# EAGLE design wt12_uart_breakout_board_v10 (EAGLE 5.11)
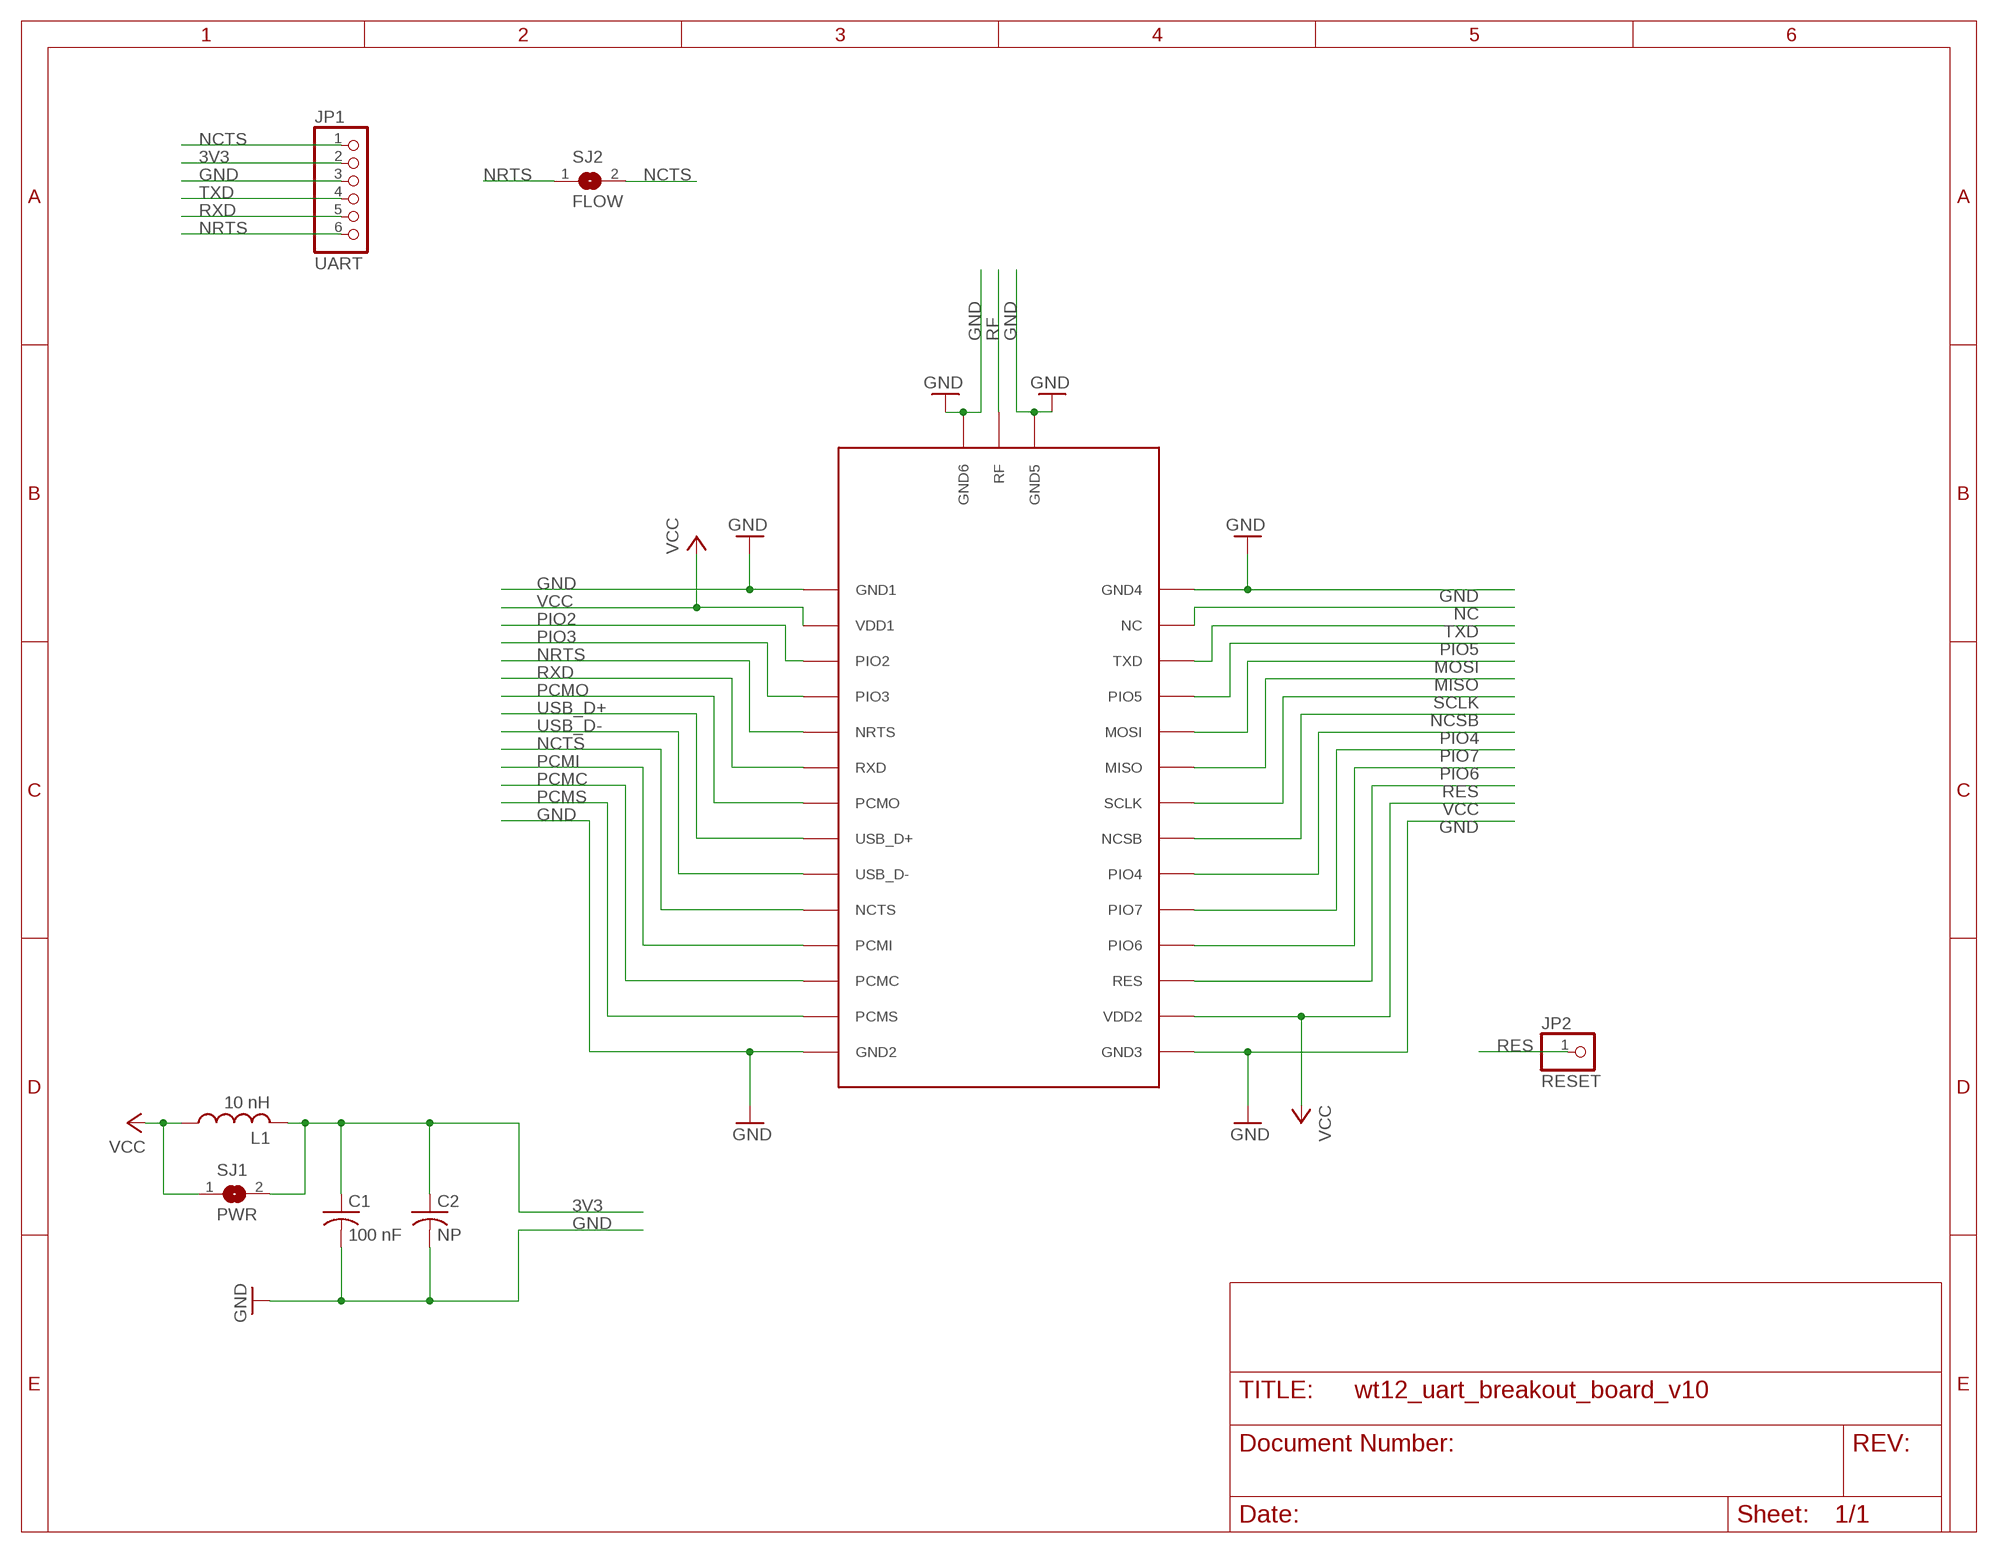
[diagram p0: schematic, sheet 1]

## Parts
C1  100 nF  C-US025-025X050  [C025-025X050]
C2  NP  C-US025-025X050  [C025-025X050]
JP1  UART  PINHD-1X6  [1X06]
JP2  RESET  PINHD-1X1  [1X01]
L1  10 nH  L-US0204/7  [0204/7]
SJ1  PWR  SJ  [SJ]
SJ2  FLOW  SJ  [SJ]
U1  WT12  [WT12]

## Nets
3V3: C1.1 C2.1 JP1.2 L1.2 SJ1.2
GND: C1.2 C2.2 JP1.3 U1.GND1 U1.GND2 U1.GND3 U1.GND4 U1.GND5 U1.GND6
MISO: U1.MISO
MOSI: U1.MOSI
NC: U1.NC
NCSB: U1.NCSB
NCTS: JP1.1 SJ2.2 U1.NCTS
NRTS: JP1.6 SJ2.1 U1.NRTS
PCMC: U1.PCMC
PCMI: U1.PCMI
PCMO: U1.PCMO
PCMS: U1.PCMS
PIO2: U1.PIO2
PIO3: U1.PIO3
PIO4: U1.PIO4
PIO5: U1.PIO5
PIO6: U1.PIO6
PIO7: U1.PIO7
RES: JP2.1 U1.RES
RF: U1.RF
RXD: JP1.5 U1.RXD
SCLK: U1.SCLK
TXD: JP1.4 U1.TXD
USB_D+: U1.USB_D+
USB_D-: U1.USB_D-
VCC: L1.1 SJ1.1 U1.VDD1 U1.VDD2

## Library data of the parts
C1 C2 = resistor:C-US: CAPACITOR, American symbol
JP1 = pinhead:PINHD-1X6: PIN HEADER
JP2 = pinhead:PINHD-1X1: PIN HEADER
L1 = resistor:L-US: INDUCTOR, American symbol
SJ1 SJ2 = jumper:SJ: SMD solder JUMPER
U1 = wt12:WT12: WT12 is a class 2, Bluetooth 2.1 + EDR module. It's a highly integrated Bluetooth module, containing all the necessary elements from Bluetooth radio to antenna, and a fully implemented iWRAP protocol stack. Key Features: - Bluetooth class 2 - Integrated chip antenna - Enhanced Data Rates (EDR) with data throughput up to 2-3Mbps - Support for Adaptive Frequency Hopping (AFH) and 802.11 co-existence - USB version 2.0, UART with bypass mode, GPIO and PCM interfaces - 8MB flash memory - Size: 26 x 14 x 2,4mm - Simple iWRAP firmware for controlling Bluetooth wireless technology - Industrial temperature range from -40C to +85C - Based on CSR BC04 chipset - RoHS compliant - Up to 14 supported Bluetooth profiles in iWRAP firmware - Support for on-board applications - Fully qualified end product with Bluetooth 2.1 + EDR, CE, FCC and IC Bluegiga WT12 provides an ideal solution for developers that want to integrate Bluetooth wireless technology to their design with limited knowledge of Bluetooth and RF technologies. By using WT12 combined with Bluegiga's complete development, testing and verification service offering, and excellent developer support, OEMs and designers ensure that their products reach the market rapidly and cost-effectively in relation to time and resources. Bluegiga has in-house knowledge of both software and hardware - offering customers a single point of contact for all Bluetooth related issues.

## Net classes
0 default: width 0.254 mm, drill 0.508 mm, clearance 0.254 mm

## Board
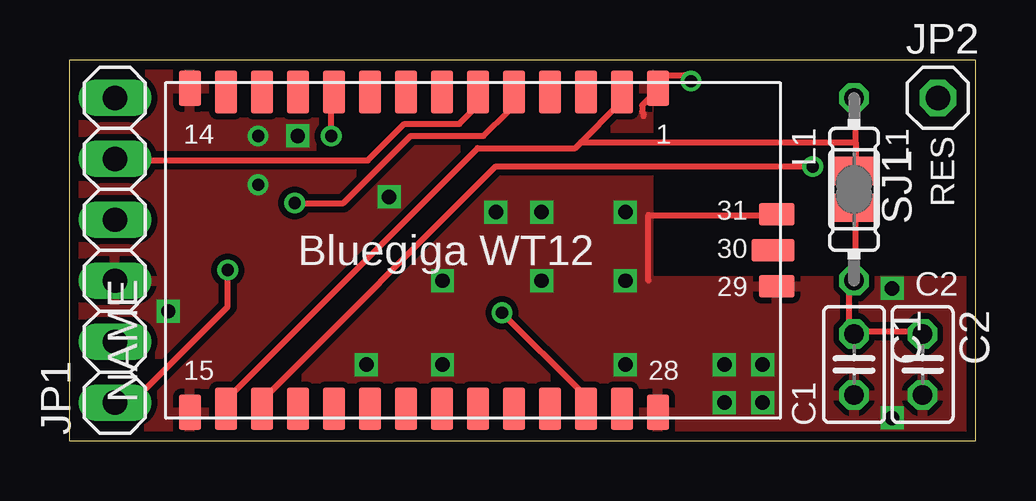
[diagram p1: board, top side]
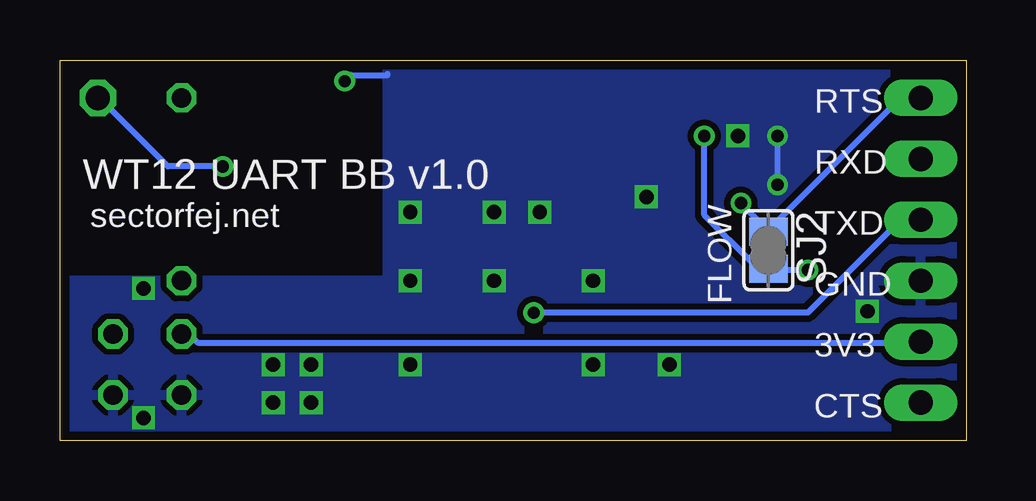
[diagram p2: board, bottom side, seen from below]

Size 37.77 x 15.87 mm. Coordinates in mm from the lower left corner, seen from the top.
Outline: 0,0 37.77,0 37.77,15.87 0,15.87 0,0
Copper layers (1*16): Top 0.0356mm / dielectric 1.5011mm / Bottom 0.0356mm
Design rules "LaenPCBOrder": minimum track width 6mil, minimum drill 13mil, track to track 6mil, track to pad 6mil, pad to pad 6mil, via to via 6mil, smd to smd 6mil, copper to edge 15mil, drill to drill 6mil, minimum pad ring 7mil, minimum via ring 7mil, stop-mask expansion 4mil, vias tented up to drill 0mil, thermal gap 10mil

### Footprints (pad centres in the part's own frame; a part is rotated, then mirrored left to right if it is on the bottom)
C025-025X050 = drill 0.813 octagon: 1 -1.27,0; 2 1.27,0
1X06 = drill 1.016 long: 1 -6.35,0; 2 -3.81,0; 3 -1.27,0; 4 1.27,0; 5 3.81,0; 6 6.35,0
1X01 = drill 1.016 octagon: 1 0,0
0204/7 = drill 0.813 octagon: 1 -3.81,0; 2 3.81,0
SJ = smd 1.168 x 1.6: 1 -0.762,0; 2 0.762,0
WT12 = smd 0.914 x 1.478: GND1 7.7,6.75; GND2 -11.8,6.75; GND3 -11.8,-6.75; GND4 7.7,-6.75 | smd 1.478 x 0.914: GND5 12.65,-1.5; GND6 12.65,1.5 | smd 0.914 x 1.778: MISO 0.2,-6.6; MOSI 1.7,-6.6; NC 6.2,-6.6; NCSB -2.8,-6.6; NCTS -5.8,6.6; NRTS 1.7,6.6; PCMC -8.8,6.6; PCMI -7.3,6.6; PCMO -1.3,6.6; PCMS -10.3,6.6; PIO2 4.7,6.6; PIO3 3.2,6.6; PIO4 -4.3,-6.6; PIO5 3.2,-6.6; PIO6 -7.3,-6.6; PIO7 -5.8,-6.6; RES -8.8,-6.6; RXD 0.2,6.6; SCLK -1.3,-6.6; TXD 4.7,-6.6; USB_D+ -2.8,6.6; USB_D- -4.3,6.6; VDD1 6.2,6.6; VDD2 -10.3,-6.6 | smd 1.778 x 0.914: RF 12.5,0

### Placement (x,y rotation side)
C1  32.7,3.17 270 top
C2  35.56,3.17 270 top
JP1  1.91,7.94 90 top
JP2  36.2,14.29 0 top
L1  32.7,10.48 270 top
SJ1  32.7,10.48 270 top
SJ2  8.26,7.94 270 bottom
U1  16.83,7.94 0 top

### Tracks (layer width: path | path; a pad name or v marks a point on that pad's centre or on a via)
3V3
  Top 0.254: SJ1.2 32.77,9.65 32.77,6.86 L1.2 32.51,6.6 32.51,4.57 C1.1 32.77,4.57 35.56,4.57 C2.1
  Bottom 0.254: JP1.2 2.03,4.06 32,4.06 32.51,4.57 C1.1
GND  (via drill 0.51, 0.6)
  Top 0.254: U1.GND6 29.46,9.4 24.13,9.4 24.13,6.67 | 23.94,13.53 23.88,13.72 23.88,13.97 24.38,14.48 U1.GND1 24.64,14.73 24.64,15.24 25.65,15.24 v25.91,14.99
  Bottom 0.254: v7.87,10.67 v7.87,12.7 | v25.91,14.99 25.65,15.24 24.13,15.24 24.13,15.28
  other vias: 4.13,5.4 12.38,3.17 15.56,3.17 15.56,6.67 19.68,6.67 23.18,6.67 23.18,9.53 19.68,9.53 17.78,9.53 13.34,10.16 9.53,12.7 23.18,3.17 27.3,3.17 27.3,1.59 28.89,1.59 28.89,3.17 34.29,6.35 34.29,0.95
  pour Bottom: 0,15.88 24.13,15.88 24.13,6.67 37.78,6.67 37.78,0 0,0
  pour Top: 0,15.88 24.13,15.88 24.13,6.67 37.78,6.67 37.78,0 0,0
NCTS  (via drill 0.51)
  Top 0.254: v6.6,7.11 6.6,5.59 2.79,1.78 2.03,1.78 JP1.1 | v10.92,12.7 10.92,14.48 U1.NCTS
  Bottom 0.254: v6.6,7.11 8.13,7.11 SJ2.2 8.38,7.37 8.89,7.37 10.92,9.4 v10.92,12.7
NRTS  (via drill 0.51)
  Top 0.254: v9.4,9.91 11.43,9.91 14.22,12.7 17.27,12.7 18.29,13.72 18.29,14.48 U1.NRTS
  Bottom 0.254: JP1.6 2.03,14.22 2.79,14.22 8.13,8.89 SJ2.1 8.38,8.89 v9.4,9.91
RES  (via drill 0.51)
  Top 0.254: v30.99,11.43 17.78,11.43 8.13,1.78 8.13,1.52 U1.RES
  Bottom 0.254: v30.99,11.43 33.27,11.43 36.07,14.22 JP2.1
RXD
  Top 0.254: U1.RXD 17.02,14.48 17.02,13.97 16.26,13.21 13.97,13.21 12.45,11.68 2.03,11.68 JP1.5
TXD  (via drill 0.51)
  Top 0.254: v18.03,5.33 21.34,2.03 21.34,1.52 U1.TXD
  Bottom 0.254: v18.03,5.33 6.6,5.33 2.79,9.14 2.03,9.14 JP1.4
VCC
  Top 0.254: 32.77,12.45 32.77,14.22 L1.1 | 32.77,12.45 32.77,11.43 SJ1.1 | 21.34,12.45 22.86,13.97 22.86,14.48 U1.VDD1 | 21.34,12.45 21.08,12.19 17.02,12.19 6.6,1.78 6.6,1.52 U1.VDD2 | 21.34,12.45 32.77,12.45

### Text on the board
tPlace: RES | 14 | 1 | L1 | 31 | 30 | Bluegiga WT12 | 29 | C2 | 15 | 28 | C1
bPlace: RTS | RXD | FLOW | WT12 UART BB v1.0 | TXD | sectorfej.net | GND | 3V3 | CTS